# Altium schematic sheet adv7280m.SchDoc
size A4
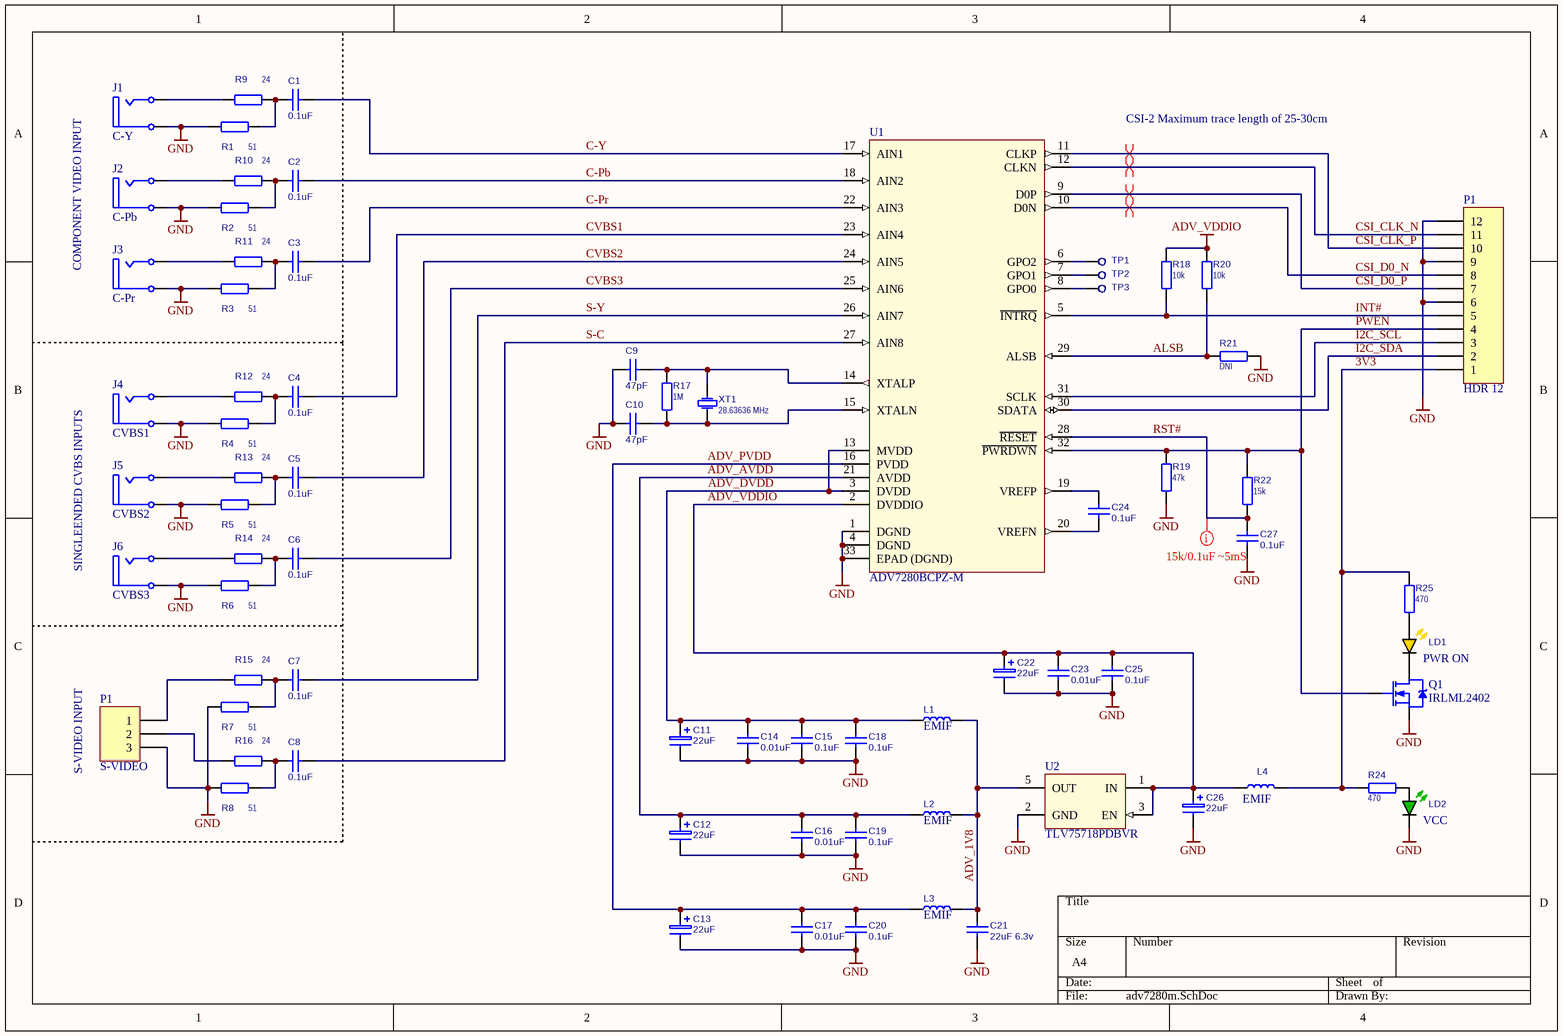
[diagram p0: adv7280m.SchDoc]

## Parts
(Parts that share a designator on the sheet are numbered #1, #2 ... from top to bottom, then left to right.)
C1  value 0.1uF  [C0603]  (hidden comment: C1608X7R1H104K080AA)
C2  value 0.1uF  [C0603]  (hidden comment: C1608X7R1H104K080AA)
C3  value 0.1uF  [C0603]  (hidden comment: C1608X7R1H104K080AA)
C4  value 0.1uF  [C0603]  (hidden comment: C1608X7R1H104K080AA)
C5  value 0.1uF  [C0603]  (hidden comment: C1608X7R1H104K080AA)
C6  value 0.1uF  [C0603]  (hidden comment: C1608X7R1H104K080AA)
C7  value 0.1uF  [C0603]  (hidden comment: C1608X7R1H104K080AA)
C8  value 0.1uF  [C0603]  (hidden comment: C1608X7R1H104K080AA)
C9  value 47pF  [C0603]  (hidden comment: CC0603JRNPO9BN470)
C10  value 47pF  [C0603]  (hidden comment: CC0603JRNPO9BN470)
C11  value 22uF  [TANTAL-A-1206]  (hidden comment: 293D226X9010A2TE3)
C12  value 22uF  [TANTAL-A-1206]  (hidden comment: 293D226X9010A2TE3)
C13  value 22uF  [TANTAL-A-1206]  (hidden comment: 293D226X9010A2TE3)
C14  value 0.01uF  [C0603]  (hidden comment: CL10B103KB8NNNC)
C15  value 0.1uF  [C0603]  (hidden comment: C1608X7R1H104K080AA)
C16  value 0.01uF  [C0603]  (hidden comment: CL10B103KB8NNNC)
C17  value 0.01uF  [C0603]  (hidden comment: CL10B103KB8NNNC)
C18  value 0.1uF  [C0603]  (hidden comment: C1608X7R1H104K080AA)
C19  value 0.1uF  [C0603]  (hidden comment: C1608X7R1H104K080AA)
C20  value 0.1uF  [C0603]  (hidden comment: C1608X7R1H104K080AA)
C21  value 22uF 6.3v  [C0805]  (hidden comment: CL21A226MQQNNNE)
C22  value 22uF  [TANTAL-A-1206]  (hidden comment: 293D226X9010A2TE3)
C23  value 0.01uF  [C0603]  (hidden comment: CL10B103KB8NNNC)
C24  value 0.1uF  [C0603]  (hidden comment: C1608X7R1H104K080AA)
C25  value 0.1uF  [C0603]  (hidden comment: C1608X7R1H104K080AA)
C26  value 22uF  [TANTAL-A-1206]  (hidden comment: 293D226X9010A2TE3)
C27  value 0.1uF  [C0603]  (hidden comment: C1608X7R1H104K080AA)
J1  C-Y  [RCJ-044]
J2  C-Pb  [RCJ-044]
J3  C-Pr  [RCJ-044]
J4  CVBS1  [RCJ-044]
J5  CVBS2  [RCJ-044]
J6  CVBS3  [RCJ-044]
L1  value EMIF  [IND0603]  (hidden comment: BLM18AG102SN1D)
L2  value EMIF  [IND0603]  (hidden comment: BLM18AG102SN1D)
L3  value EMIF  [IND0603]  (hidden comment: BLM18AG102SN1D)
L4  value EMIF  [IND0603]  (hidden comment: BLM18AG102SN1D)
LD1  LED_Y  [R0805]  (value not drawn)
LD2  LED_G  [R0805]  (value not drawn)
P1#1  HDR 12  [1.25-12AW]
P1#2  S-VIDEO  [PLS-3R]
Q1  IRLML2402  [SOT-23-3]
R1  51  [R0603]
R2  51  [R0603]
R3  51  [R0603]
R4  51  [R0603]
R5  51  [R0603]
R6  51  [R0603]
R7  51  [R0603]
R8  51  [R0603]
R9  24  [R0603]
R10  24  [R0603]
R11  24  [R0603]
R12  24  [R0603]
R13  24  [R0603]
R14  24  [R0603]
R15  24  [R0603]
R16  24  [R0603]
R17  1M  [R0603]
R18  10k  [R0603]
R19  47k  [R0603]
R20  10k  [R0603]
R21  DNI  [R0603]
R22  15k  [R0603]
R24  470  [R0603]
R25  470  [R0603]
TP1  TEST-POINT  [PAD]  (value not drawn)
TP2  TEST-POINT  [PAD]  (value not drawn)
TP3  TEST-POINT  [PAD]  (value not drawn)
U1  ADV7280BCPZ-M  [CP-32-12]
U2  TLV75718PDBVR  [SOT-23-5]
XT1  28.63636 MHz  [HC-49/S-SMD]

## Nets
ADV_VDDIO: C22.1(+) C23.1 C25.1 C26.1(+) L4.1 R18.2 R20.2 U1.2(DVDDIO) U2.1(IN) U2.3(EN)
GND: C9.2 C10.2 C11.2(-) C12.2(-) C13.2(-) C14.2 C15.2 C16.2 C17.2 C18.2 C19.2 C20.2 C21.1 C22.2(-) C23.2 C25.2 C26.2(-) C27.2 J1.1(Ground) J2.1(Ground) J3.1(Ground) J4.1(Ground) J5.1(Ground) J6.1(Ground) LD2.1 P1#1.6 P1#1.9 P1#1.12 P1#2.3 Q1.2(S) R1.1 R2.1 R3.1 R4.1 R5.1 R6.1 R7.1 R8.1 R19.1 R21.1 U1.1(DGND) U1.4(DGND) U1.33(EPAD_(DGND)) U2.2(GND)
3V3: L4.2 P1#1.1 R24.2 R25.2
ADV_1V8: C21.2 L1.2 L2.2 L3.2 U2.5(OUT)
ADV_AVDD: C12.1(+) C16.1 C19.1 L2.1 U1.21(AVDD)
ADV_DVDD: C11.1(+) C14.1 C15.1 C18.1 L1.1 U1.3(DVDD) U1.13(MVDD)
ADV_PVDD: C13.1(+) C17.1 C20.1 L3.1 U1.16(PVDD)
ALSB: R20.1 R21.2 U1.29(ALSB)
C-Pb: C2.1 U1.18(AIN2)
C-Pr: C3.1 U1.22(AIN3)
C-Y: C1.1 U1.17(AIN1)
CSI_CLK_N: P1#1.11 U1.12(CLKN)
CSI_CLK_P: P1#1.10 U1.11(CLKP)
CSI_D0_N: P1#1.8 U1.10(D0N)
CSI_D0_P: P1#1.7 U1.9(D0P)
CVBS1: C4.1 U1.23(AIN4)
CVBS2: C5.1 U1.24(AIN5)
CVBS3: C6.1 U1.25(AIN6)
I2C_SCL: P1#1.3 U1.31(SCLK)
I2C_SDA: P1#1.2 U1.30(SDATA)
INT#: P1#1.5 R18.1 U1.5(~{INTRQ})
PWEN: P1#1.4 Q1.1(G) R19.2 R22.1 U1.32(~{PWRDWN})
RST#: C27.1 R22.2 U1.28(~{RESET})
S-C: C8.1 U1.27(AIN8)
S-Y: C7.1 U1.26(AIN7)
NetC1_2: C1.2 R1.2 R9.1
NetC2_2: C2.2 R2.2 R10.1
NetC3_2: C3.2 R3.2 R11.1
NetC4_2: C4.2 R4.2 R12.1
NetC5_2: C5.2 R5.2 R13.1
NetC6_2: C6.2 R6.2 R14.1
NetC7_2: C7.2 R7.2 R15.1
NetC8_2: C8.2 R8.2 R16.1
NetC9_1: C9.1 R17.1 U1.14(XTALP) XT1.1
NetC10_1: C10.1 R17.2 U1.15(XTALN) XT1.2
NetC24_1: C24.1 U1.19(VREFP)
NetC24_2: C24.2 U1.20(VREFN)
NetJ1_2: J1.2(Signal) R9.2
NetJ2_2: J2.2(Signal) R10.2
NetJ3_2: J3.2(Signal) R11.2
NetJ4_2: J4.2(Signal) R12.2
NetJ5_2: J5.2(Signal) R13.2
NetJ6_2: J6.2(Signal) R14.2
NetLD1_1: LD1.1 Q1.3(D)
NetLD1_2: LD1.2 R25.1
NetLD2_2: LD2.2 R24.1
NetP1#2_1: P1#2.1 R15.2
NetP1#2_2: P1#2.2 R16.2
NetTP1_1: TP1.1 U1.6(GPO2)
NetTP2_1: TP2.1 U1.7(GPO1)
NetTP3_1: TP3.1 U1.8(GPO0)

## Layout directives
differential pair: CSI_CLK_N, CSI_CLK_P, CSI_D0_N, CSI_D0_P
mark named 15k/0.1uF ~5mS: RST#

## Notes on the sheet
- CSI-2 Maximum trace length of 25-30cm
- COMPONENT VIDEO INPUT
- SINGLEENDED CVBS INPUTS
- PWR ON
- S-VIDEO INPUT
- (near LD2) VCC

## Library data of the parts
C1-C10 C14-C21 C23-C25 C27 = CAP_NPOL
C11-C13 C22 C26 = CAP_POL
J1-J6 = RCA: RCA Phono Jack, Right Angle, Thru-Hole, Snap-In
L1-L4 = IND_WO_IRON
LD1 = LED_YELLOW: LED Yellow; Value: *
LD2 = LED_GREEN: LED Green; Value: *
P1#1 = HDR 12: Header, 12-Pin; LatestRevisionDate: 17-Jul-2002; LatestRevisionNote: Re-released for DXP Platform.; Publisher: Altium Limited
P1#2 = HDR 3: Header, 3-Pin; LatestRevisionDate: 17-Jul-2002; LatestRevisionNote: Re-released for DXP Platform.; Publisher: Altium Limited
Q1 = N-Channel: HEXFET Power MOSFET
R1-R22 R24 R25 = RESISTOR: RES
  R1-R8: Value: 51
  R9-R16: Value: 24
  R17: Value: 1M
  R18 R20: Value: 10k
  R19: Value: 47k
  R21: Value: DNI
  R22: Value: 15k
  R24 R25: Value: 470
TP1-TP3 = TEST-POINT: PCB terminal block; Value: *
U1 = ADV7280BCPZ-M: 10-Bit, 4xOversampling SDTV Video Decoder; Value: ADV7280BCPZ-M
U2 = TLV733P: Capacitor-Free, 300-mA, Low-Dropout Regulator with Foldback Current Limit for Portable Devices; value: TLV733P
XT1 = XTAL: Value: 28.63636 MHz